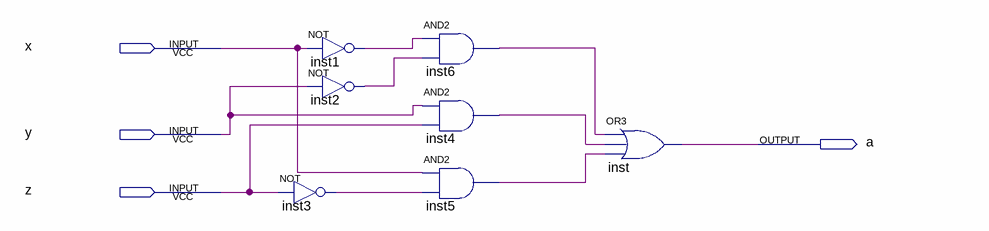
[diagram p0: schematic sheet]
// Quartus schematic Circuito-A.bdf as structural Verilog: 7 symbols, 4 pins
module \Circuito-A  (
  input  x,
  input  y,
  input  z,
  output a
);

  wire inst1_out, inst2_out, inst3_out, inst4_out, inst5_out, inst6_out;

  not inst3 (inst3_out, z);
  not inst1 (inst1_out, x);
  not inst2 (inst2_out, y);
  and inst6 (inst6_out, inst1_out, inst2_out);
  and inst4 (inst4_out, y, z);
  and inst5 (inst5_out, x, inst3_out);
  or inst (a, inst6_out, inst4_out, inst5_out);
endmodule
